# Altium project diyBMS.PrjPcb
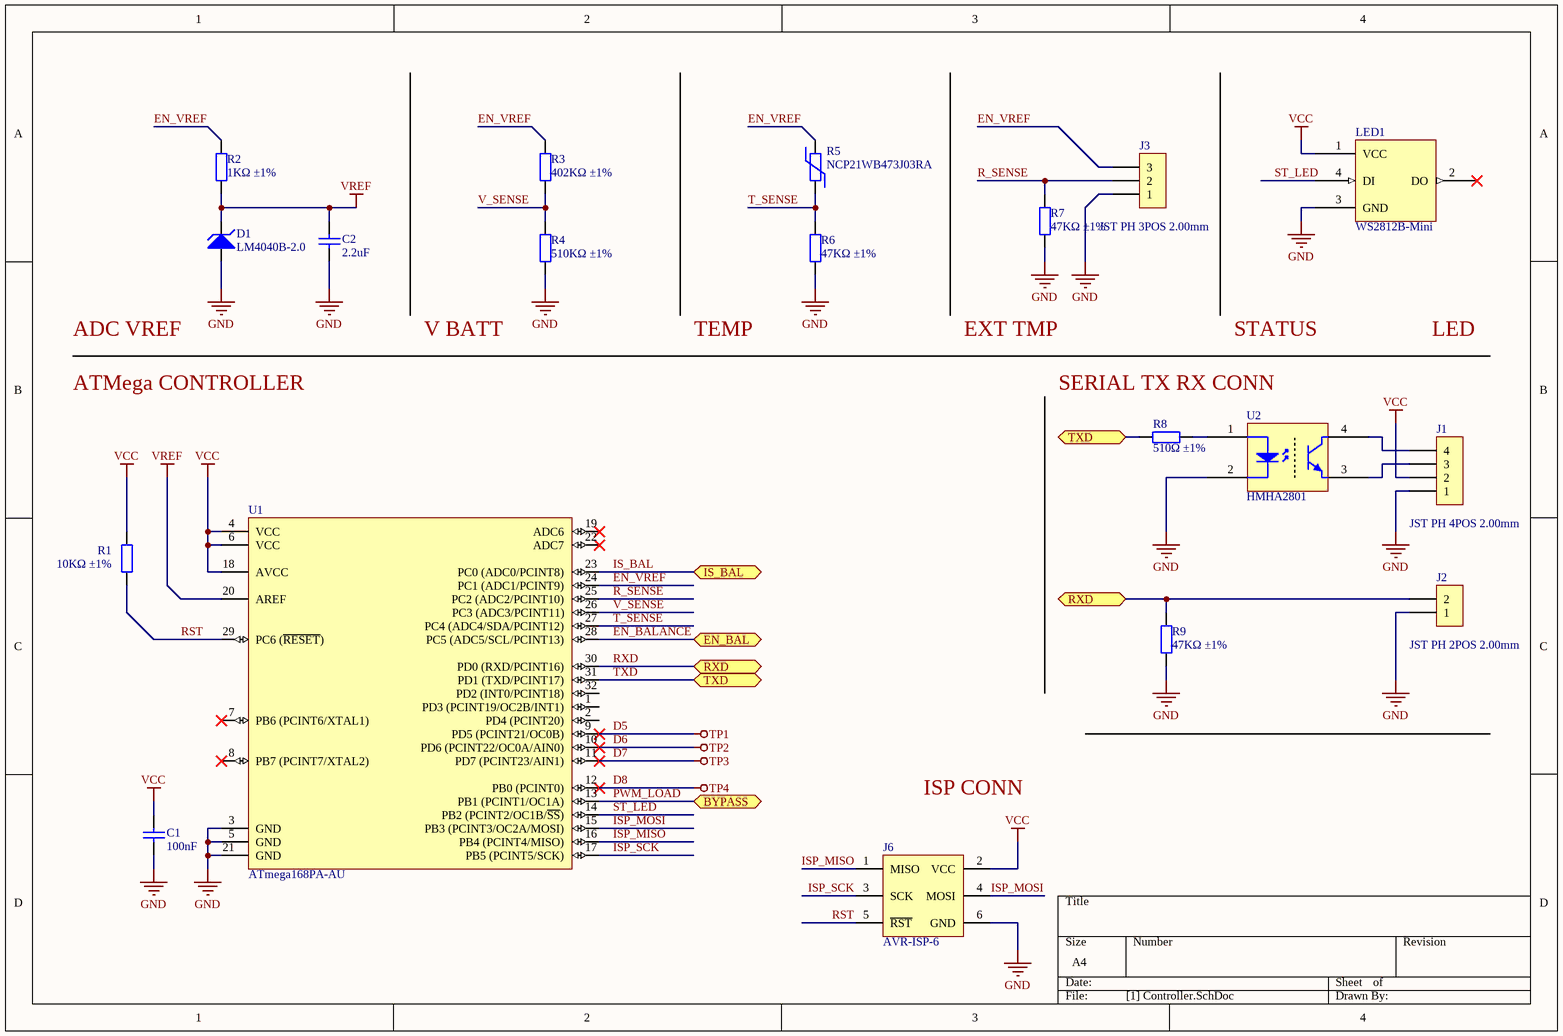
[diagram p0: [1] Controller.SchDoc]
ProjectName: diyBMS Cell Module
2 sheets, 49 parts. Net scope: flat (ports and power ports of the same name join across sheets).
Board file: board.PcbDoc
Sheets:
  [1] Controller.SchDoc
  [2] Bypass Balance.SchDoc

## Sheet [1] Controller.SchDoc
size A4; DocumentNumber: 1; SheetNumber: 1

### Parts
C1  100nF  [0805_C]
C2  2.2uF  [0805_C]
D1  LM4040B-2.0  [SOT-23(SOT-23-3)]
J1  JST PH 4POS 2.00mm  [JST_PH_S4B]
J2  JST PH 2POS 2.00mm  [JST_PH_S2B]
J3  JST PH 3POS 2.00mm  [JST_PH_S3B]
J6  AVR-ISP-6  [PINHEADER_6POS_2ROW_2.54]
LED1  WS2812B-Mini  [LED3535_4P]
R1  10KΩ ±1%  [0805_R]
R2  1KΩ ±1%  [0805_R]
R3  402KΩ ±1%  [0805_R]
R4  510KΩ ±1%  [0805_R]
R5  NCP21WB473J03RA  [0805_R]
R6  47KΩ ±1%  [0805_R]
R7  47KΩ ±1%  [0805_R]
R8  510Ω ±1%  [0805_R]
R9  47KΩ ±1%  [0805_R]
U1  ATmega168PA-AU  [TQFP-32_7x7x08P]
U2  HMHA2801  [HMHA2801]

### Ports
BYPASS (bidir), EN_BAL (bidir), IS_BAL (bidir), RXD (bidir), TXD (bidir)

### Nets
D5: U1.9(PD5_(PCINT21/OC0B))  [also labelled TP1]
D6: U1.10(PD6_(PCINT22/OC0A/AIN0))  [also labelled TP2]
D7: U1.11(PD7_(PCINT23/AIN1))  [also labelled TP3]
D8: U1.12(PB0_(PCINT0))  [also labelled TP4]
GND: C1.1 C2.1 D1.2(A) J1.1 J2.1 J3.1 J6.6(GND) LED1.3(GND) R4.1 R6.1 R7.1 R9.1 U1.3(GND) U1.5(GND) U1.21(GND) U2.2(A)
VCC: C1.2 J1.2 J6.2(VCC) LED1.1(VCC) R1.1 U1.4(VCC) U1.6(VCC) U1.18(AVCC)
VREF: C2.2 D1.1(K) R2.1 U1.20(AREF)
EN_BALANCE: U1.28(PC5_(ADC5/SCL/PCINT13)) ; port EN_BAL
EN_VREF: J3.3 R2.2 R3.2 R5.2 U1.24(PC1_(ADC1/PCINT9))
IS_BAL: U1.23(PC0_(ADC0/PCINT8)) ; port IS_BAL
ISP_MISO: J6.1(MISO) U1.16(PB4_(PCINT4/MISO))
ISP_MOSI: J6.4(MOSI) U1.15(PB3_(PCINT3/OC2A/MOSI))
ISP_SCK: J6.3(SCK) U1.17(PB5_(PCINT5/SCK))
PWM_LOAD: U1.13(PB1_(PCINT1/OC1A)) ; port BYPASS
R_SENSE: J3.2 R7.2 U1.25(PC2_(ADC2/PCINT10))
RST: J6.5(~{RST}) R1.2 U1.29(PC6_(~{RESET}))
RXD: J2.2 R9.2 U1.30(PD0_(RXD/PCINT16)) ; port RXD
ST_LED: LED1.4(DI) U1.14(PB2_(PCINT2/OC1B/~{SS}))
T_SENSE: R5.1 R6.2 U1.27(PC4_(ADC4/SDA/PCINT12))
TXD: R8.1 U1.31(PD1_(TXD/PCINT17)) ; port TXD
V_SENSE: R3.1 R4.2 U1.26(PC3_(ADC3/PCINT11))
NetJ1_3: J1.3 U2.3
NetJ1_4: J1.4 U2.4
NetR8_2: R8.2 U2.1

Not connected (* = marked no-connect by the designer): LED1 2(DO)*; U1 1(PD3_(PCINT19/OC2B/INT1)) 2(PD4_(PCINT20)) 7(PB6_(PCINT6/XTAL1))* 8(PB7_(PCINT7/XTAL2))* 19(ADC6)* 22(ADC7)* 32(PD2_(INT0/PCINT18))

### Notes on the sheet
- ADC VREF
- V BATT
- TEMP
- EXT TMP
- STATUS
- LED
- ATMega CONTROLLER
- SERIAL TX RX CONN
- ISP CONN

### Library data of the parts
C1 = 0805 100nF(104) 10% 50V: Chip capacitors; Manufacturer: YAGEO; PartNumber: CC0805KRX7R9BB104; Tolerance: 10%; Voltage: 50V; ComponentLink1Description: Supplier link; ComponentLink1URL: http://www.szlcsc.com/product/details_50686.html; Package: 0805; Supplier: LC; SuppliersPartNumber: C49678; Capacitance: 100nF
C2 = 0805 2.2uF (225) 20% 50V: Chip capacitors; Manufacturer: Guangdong Fenghua Advanced Tech; PartNumber: 0805F225M500NT; Tolerance: 20%; Voltage: 50V; ComponentLink1Description: Supplier link; ComponentLink1URL: http://www.szlcsc.com/product/details_50225.html; Package: 0805; Supplier: LC; SuppliersPartNumber: C49217; Capacitance: 2.2uF
D1 = LM4040B-2.0: Precision Shunt Voltage Reference
J1 = JST_PH_4POS: JST-PH Conn; Manufacturer: JST Sales America; PartNumber: S4B-PH-K-S(LF)(SN); Positions: 3; Row: 1; ComponentLink1Description: Datasheet; ComponentLink1URL: https://datasheet.lcsc.com/szlcsc/1810261107_JST-Sales-America-S4B-PH-K-S-LF-SN_C157926.pdf; Supplier: LC; Type: Male; Notepad: *; SuppliersPartNumber: C157926; ComponentLink2Description: Supplier link; ComponentLink2URL: https://lcsc.com/product-detail/Wire-To-Board-Wire-To-Wire-Connector_JST-Sales-America-S4B-PH-K-S-LF-SN_C157926.html
J2 = JST_PH_2POS: JST-PH Conn; Manufacturer: JST Sales America; PartNumber: S2B-PH-K-S(LF)(SN); Positions: 2; Row: 1; ComponentLink1Description: Datasheet; ComponentLink1URL: https://datasheet.lcsc.com/szlcsc/JST-Sales-America-S2B-PH-K-S-LF-SN_C173752.pdf; Supplier: LC; Type: Male; Notepad: *; SuppliersPartNumber: C173752; ComponentLink2Description: Supplier link; ComponentLink2URL: https://lcsc.com/product-detail/Wire-To-Board-Wire-To-Wire-Connector_JST-Sales-America-S2B-PH-K-S-LF-SN_C173752.html
J3 = JST_PH_3POS: JST-PH Conn; Manufacturer: JST Sales America; PartNumber: S3B-PH-K-S(LF)(SN); Positions: 3; Row: 1; ComponentLink1Description: Datasheet; ComponentLink1URL: https://datasheet.lcsc.com/szlcsc/1810261120_JST-Sales-America-S3B-PH-K-S-LF-SN_C157929.pdf; Supplier: LC; Type: Male; Notepad: *; SuppliersPartNumber: C157929; ComponentLink2Description: Supplier link; ComponentLink2URL: https://lcsc.com/product-detail/Wire-To-Board-Wire-To-Wire-Connector_JST-Sales-America_S3B-PH-K-S-LF-SN_JST-Sales-America-S3B-PH-K-S-LF-SN_C157929.html
J6 = AVR_ISP: Manufacturer: Boom Precision Elec; PartNumber: C65114; Positions: 6; Row: 2; Supplier: LC; Type: Male; SuppliersPartNumber: C65114
LED1 = WS2812B-Mini: RGB Addressable LED; Manufacturer: Worldsemi; Package: 3535; ComponentLink1Description: Supplier link; ComponentLink1URL: https://lcsc.com/product-detail/Light-Emitting-Diodes-LED_Worldsemi-WS2812B-Mini_C114583.html; PartNumber: WS2812B-Mini; SuppliersPartNumber: C114583; Supplier: LC; Notepad: *
R1 = 0805 10K (1002) 1%: Chip resistor; Manufacturer: Uniroyal Elec; PartNumber: 0805W8F1002T5E; Power: 1/8W; ComponentLink1Description: Supplier link; ComponentLink1URL: http://www.szlcsc.com/product/details_18102.html; Package: 0805; Supplier: LC; SuppliersPartNumber: C17414; Resistance: 10KΩ; Tolerance: 1%
R2 = 0805 1K (1001) 1%: Chip resistor; Manufacturer: Uniroyal Elec; PartNumber: 0805W8F1001T5E; Power: 1/8W; ComponentLink1Description: Supplier link; ComponentLink1URL: http://www.szlcsc.com/product/details_18201.html; Package: 0805; Supplier: LC; SuppliersPartNumber: C17513; Resistance: 1KΩ; Tolerance: 1%
R3 = 0805 402K (4023) 1%: Chip resistor; Manufacturer: Uniroyal Elec; PartNumber: 0805W8F4023T5E; Power: 1/8W; Resistance: 402K; ComponentLink1Description: Supplier link; ComponentLink1URL: https://lcsc.com/product-detail/Chip-Resistor-Surface-Mount_Uniroyal-Elec-0805W8F4023T5E_C17680.html; Package: 0805; Supplier: LC; SuppliersPartNumber: C17680; Tolerance: 1%
R4 = 0805 510K (5103) 1%: Chip resistor; Manufacturer: Uniroyal Elec; PartNumber: 0805W8F4023T5E; Power: 1/8W; Resistance: 510K; ComponentLink1Description: Supplier link; ComponentLink1URL: https://lcsc.com/product-detail/Chip-Resistor-Surface-Mount_Uniroyal-Elec-0805W8F5103T5E_C17733.html; Package: 0805; Supplier: LC; SuppliersPartNumber: C17733; Tolerance: 1%
R5 = 0805 NTC 47K 5%: NTC Resistor 47K 5%; Manufacturer: Murata Electronics; Power: 1/5W; B0/50: 4050K; B Tolerance: 3%; Package: 0805; PartNumber: NCP21WB473J03RA; Resistance @25°C: 47K; Tolerance: 5%; Supplier: LC; SuppliersPartNumber: C113141; Notepad: *; ComponentLink1Description: Supplier link; ComponentLink1URL: https://lcsc.com/product-detail/NTC-Thermistors_Murata-Electronics-NCP21WB473J03RA_C113141.html
R6 R7 R9 = 0805 47K (4702) 1%: Chip resistor; Manufacturer: Uniroyal Elec; PartNumber: 0805W8F4702T5E; Power: 1/8W; ComponentLink1Description: Supplier link; ComponentLink1URL: http://www.szlcsc.com/product/details_18401.html; Package: 0805; Supplier: LC; SuppliersPartNumber: C17713; Resistance: 47KΩ; Tolerance: 1%
R8 = 0805 510R (5100) 1%: Chip resistor; Manufacturer: Uniroyal Elec; PartNumber: 0805W8F5100T5E; Power: 1/8W; ComponentLink1Description: Supplier link; ComponentLink1URL: http://www.szlcsc.com/product/details_18422.html; Package: 0805; Supplier: LC; SuppliersPartNumber: C17734; Resistance: 510Ω; Tolerance: 1%
U1 = ATMEGA168: ATmega AVR; Manufacturer: Microchip Tech; ComponentLink1Description: Supplier Link; ComponentLink1URL: https://lcsc.com/product-detail/ATMEL-AVR_ATMEL_ATMEGA168PA-AU_ATMEGA168PA-AU_C8728.html; ComponentLink2Description: Datasheet; ComponentLink2URL: https://datasheet.lcsc.com/szlcsc/1809061822_Microchip-Tech-ATMEGA168PA-AU_C8728.pdf; Package: TQFP-32_7x7x08P; PartNumber: ATMEGA168PA-AU; Supplier: LC; SuppliersPartNumber: C8728; Notepad: *
U2 = HMHA2801: Optocoupler; Manufacturer: ON Semicon; PartNumber: HMHA2801AR2; ComponentLink1Description: Supplier Link; ComponentLink1URL: https://lcsc.com/product-detail/Optocouplers_ON-Semicon_HMHA2801AR2_ON-Semicon-ON-HMHA2801AR2_C258257.html; Package: SOIC-4; Supplier: LC; SuppliersPartNumber: C258257

## Sheet [2] Bypass Balance.SchDoc
size A4; DocumentNumber: 2; SheetNumber: 2
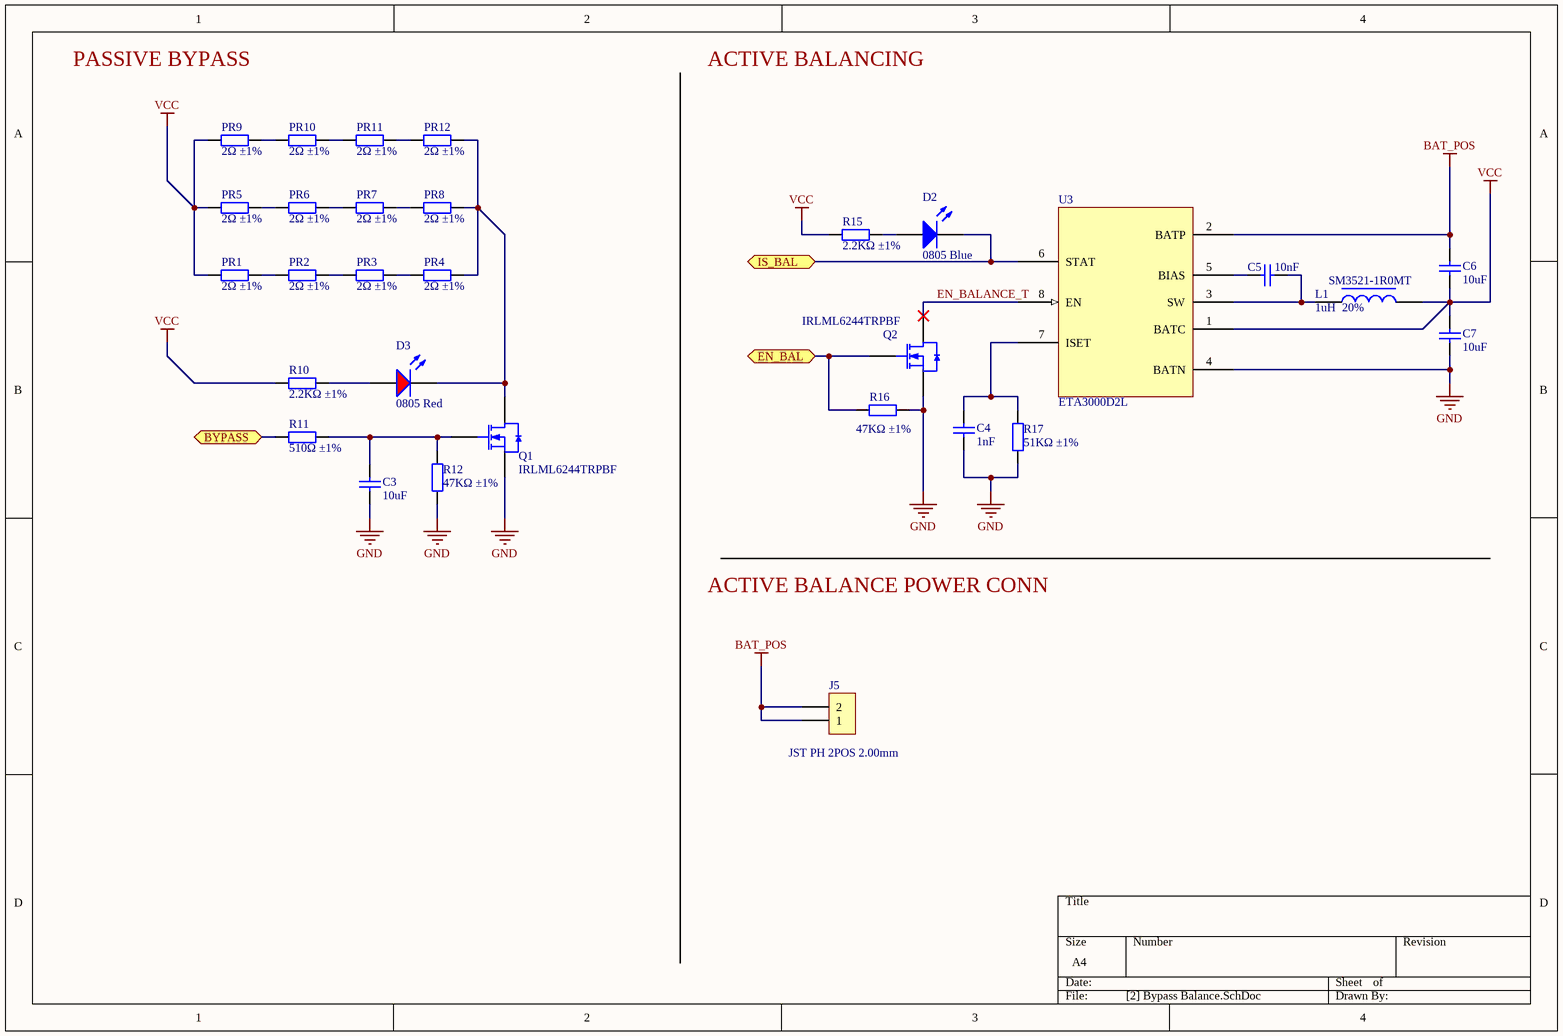
[diagram p1: [2] Bypass Balance.SchDoc]

### Parts
C3  10uF  [0805_C]
C4  1nF  [0805_C]
C5  10nF  [0805_C]
C6  10uF  [0805_C]
C7  10uF  [0805_C]
D2  0805 Blue  [0805_LED_S1]
D3  0805 Red  [0805_LED_S1]
J5  JST PH 2POS 2.00mm  [JST_PH_S2B]
L1  SM3521-1R0MT  Tolerance: 20%  Inductance: 1uH  [3521_L]
PR1  2Ω ±1%  [2512_R]
PR2  2Ω ±1%  [2512_R]
PR3  2Ω ±1%  [2512_R]
PR4  2Ω ±1%  [2512_R]
PR5  2Ω ±1%  [2512_R]
PR6  2Ω ±1%  [2512_R]
PR7  2Ω ±1%  [2512_R]
PR8  2Ω ±1%  [2512_R]
PR9  2Ω ±1%  [2512_R]
PR10  2Ω ±1%  [2512_R]
PR11  2Ω ±1%  [2512_R]
PR12  2Ω ±1%  [2512_R]
Q1  IRLML6244TRPBF  [SOT-23(SOT-23-3)]
Q2  IRLML6244TRPBF  [SOT-23(SOT-23-3)]
R10  2.2KΩ ±1%  [0805_R]
R11  510Ω ±1%  [0805_R]
R12  47KΩ ±1%  [0805_R]
R15  2.2KΩ ±1%  [0805_R]
R16  47KΩ ±1%  [0805_R]
R17  51KΩ ±1%  [0805_R]
U3  ETA3000D2L  [DFN2x2-8L]

### Ports
BYPASS (bidir), EN_BAL (bidir), IS_BAL (bidir)

### Nets
BAT_POS: C6.2 J5.1 J5.2 U3.2(BATP)
GND: C3.1 C4.1 C7.1 Q1.2(S) Q2.2(S) R12.1 R16.1 R17.1 U3.4(BATN)
VCC: C6.1 C7.2 L1.2 PR1.2 PR5.2 PR9.2 R10.2 R15.1 U3.1(BATC)
EN_BALANCE: Q2.1(G) R16.2 ; port EN_BAL
EN_BALANCE_T: Q2.3(D) U3.8(EN)
IS_BAL: D2.K U3.6(STAT) ; port IS_BAL
PWM_LOAD: R11.1 ; port BYPASS
NetC3_2: C3.2 Q1.1(G) R11.2 R12.2
NetC4_2: C4.2 R17.2 U3.7(ISET)
NetC5_1: C5.1 L1.1 U3.3(SW)
NetC5_2: C5.2 U3.5(BIAS)
NetD2_A: D2.A R15.2
NetD3_A: D3.A R10.1
NetD3_K: D3.K PR4.1 PR8.1 PR12.1 Q1.3(D)
NetPR1_1: PR1.1 PR2.2
NetPR2_1: PR2.1 PR3.2
NetPR3_1: PR3.1 PR4.2
NetPR5_1: PR5.1 PR6.2
NetPR6_1: PR6.1 PR7.2
NetPR7_1: PR7.1 PR8.2
NetPR9_1: PR9.1 PR10.2
NetPR10_1: PR10.1 PR11.2
NetPR11_1: PR11.1 PR12.2

### Notes on the sheet
- PASSIVE BYPASS
- ACTIVE BALANCING
- ACTIVE BALANCE POWER CONN

### Library data of the parts
C3 C6 C7 = 0805 10uF (106) 10% 25V: Chip capacitors; Manufacturer: Samsung Electro-Mechanics; PartNumber: CL21A106KAYNNNE; Tolerance: 10%; Voltage: 25V; ComponentLink1Description: Supplier link; ComponentLink1URL: http://www.szlcsc.com/product/details_16532.html; Package: 0805; Supplier: LC; SuppliersPartNumber: C15850; Capacitance: 10uF
C4 = 0805 1nF (102) 10% 50V: Chip capacitors; Manufacturer: Samsung Electro-Mechanics; PartNumber: CL21B102KBCNNNC; Tolerance: 10%; Voltage: 50V; ComponentLink1Description: Supplier link; ComponentLink1URL: http://www.szlcsc.com/product/details_52223.html; Package: 0805; Supplier: LC; SuppliersPartNumber: C46653; Capacitance: 1nF
C5 = 0805 10nF (103) 10% 50V: Chip capacitors; Manufacturer: Samsung Electro-Mechanics; PartNumber: CL21B103KBANNNC; Tolerance: 10%; Voltage: 50V; ComponentLink1Description: Supplier link; ComponentLink1URL: http://www.szlcsc.com/product/details_2062.html; Package: 0805; Supplier: LC; SuppliersPartNumber: C1710; Capacitance: 10nF
D2 = 0805 LED Blue: LED; ComponentLink1Description: 供应商链接; ComponentLink1URL: http://www.szlcsc.com/product/details_2666.html; Package: 0805; Supplier: LC; SuppliersPartNumber: C2293; Color: Blue
D3 = 0805 LED Red: LED; PartNumber: FC-2012HRK-620D; Manufacturer: Foshan NationStar Optoelectronics; ComponentLink1Description: 供应商链接; ComponentLink1URL: http://www.szlcsc.com/product/details_2668.html; Package: 0805; Supplier: LC; SuppliersPartNumber: C84256; Color: Red
J5 = JST_PH_2POS: as J2 on sheet [1] Controller; ComponentLink1Description: Datasheet; ComponentLink1URL: https://datasheet.lcsc.com/szlcsc/JST-Sales-America-S2B-PH-K-S-LF-SN_C173752.pdf; Supplier: LC; Type: Male; Notepad: *; SuppliersPartNumber: C173752; ComponentLink2Description: Supplier link; ComponentLink2URL: https://lcsc.com/product-detail/Wire-To-Board-Wire-To-Wire-Connector_JST-Sales-America-S2B-PH-K-S-LF-SN_C173752.html
L1 = 3521 1uH 20%: Power Inductor; Manufacturer: Shun Xiang Nuo Elec; Current: 2.2A; ComponentLink1Description: Supplier link; ComponentLink1URL: https://lcsc.com/product-detail/Power-Inductors_Shun-Xiang-Nuo-Elec-SM3521-1R0MT_C55366.html; Package: 3521; Supplier: LC; SuppliersPartNumber: C55366; PartNumber: SM3521-1R0MT
PR1-PR12 = 2512 2R (2R00) 1%: Chip resistor; Manufacturer: Uniroyal Elec; PartNumber: 25121WF200KT4E; Power: 1W; ComponentLink1Description: Supplier link; ComponentLink1URL: https://lcsc.com/product-detail/Chip-Resistor-Surface-Mount_Uniroyal-Elec-25121WF200KT4E_C49298.html; Package: 2512; Supplier: LC; SuppliersPartNumber: C49298; Resistance: 2Ω; Tolerance: 1%
Q1 Q2 = IRLML6244: MOSFET-N; Manufacturer: Infineon Technologies; ComponentLink1Description: Supplier Link; ComponentLink1URL: https://lcsc.com/product-detail/MOSFET_Infineon-Technologies-IRLML6244TRPBF_C143946.html; Package: SOT-23(SOT-23-3); Supplier: LC; SuppliersPartNumber: C143946; PartNumber: IRLML6244TRPBF
R10 R15 = 0805 2.2K (2201) 1%: Chip resistor; Manufacturer: Uniroyal Elec; PartNumber: 0805W8F2201T5E; Power: 1/8W; ComponentLink1Description: Supplier link; ComponentLink1URL: http://www.szlcsc.com/product/details_18208.html; Package: 0805; Supplier: LC; SuppliersPartNumber: C17520; Resistance: 2.2KΩ; Tolerance: 1%
R11 = 0805 510R (5100) 1%: as R8 on sheet [1] Controller; ComponentLink1Description: Supplier link; ComponentLink1URL: http://www.szlcsc.com/product/details_18422.html; Package: 0805; Supplier: LC; SuppliersPartNumber: C17734; Resistance: 510Ω; Tolerance: 1%
R12 R16 = 0805 47K (4702) 1%: as R6 on sheet [1] Controller; ComponentLink1Description: Supplier link; ComponentLink1URL: http://www.szlcsc.com/product/details_18401.html; Package: 0805; Supplier: LC; SuppliersPartNumber: C17713; Resistance: 47KΩ; Tolerance: 1%
R17 = 0805 51K (5102) 1%: Chip resistor; Manufacturer: Uniroyal Elec; PartNumber: 0805W8F5102T5E; Power: 1/8W; ComponentLink1Description: Supplier link; ComponentLink1URL: http://www.szlcsc.com/product/details_18425.html; Package: 0805; Supplier: LC; SuppliersPartNumber: C17737; Resistance: 51KΩ; Tolerance: 1%
U3 = ETA3000: Inductive Cell Balancer IC; Manufacturer: ETA Solutions; ComponentLink1Description: Datasheet; ComponentLink1URL: https://www.google.com/url?sa=t&rct=j&q=&esrc=s&source=web&cd=1&cad=rja&uact=8&ved=2ahUKEwiT6tKR3dXlAhUi_CoKHWUtB6cQFjAAegQIARAC&url=http%3A%2F%2Fwww.etasolution.com%2Fupload%2F201905%2F09%2F201905091810050738.pdf&usg=AOvVaw3laEeLP183Kq2gxYTbdcOz; PartNumber: ETA3000D2L; Supplier: *; SuppliersPartNumber: *; Package: DFN2x2-8

## Nets that join several sheets
GND: [1] Controller (16 pins), [2] Bypass Balance (9 pins)
VCC: [1] Controller (8 pins), [2] Bypass Balance (9 pins)
EN_BALANCE: [1] Controller (U1.28), [2] Bypass Balance (Q2.1 R16.2)
IS_BAL: [1] Controller (U1.23), [2] Bypass Balance (D2.K U3.6)
PWM_LOAD: [1] Controller (U1.13), [2] Bypass Balance (R11.1)